# EasyEDA schematic Schematic.json
TITLE: HMI Board; REV: 0.2.0; Date: 2020-08-12; Sheet: 1/1; Drawn By: Nibha Akireddy; Company: Prakash Lab
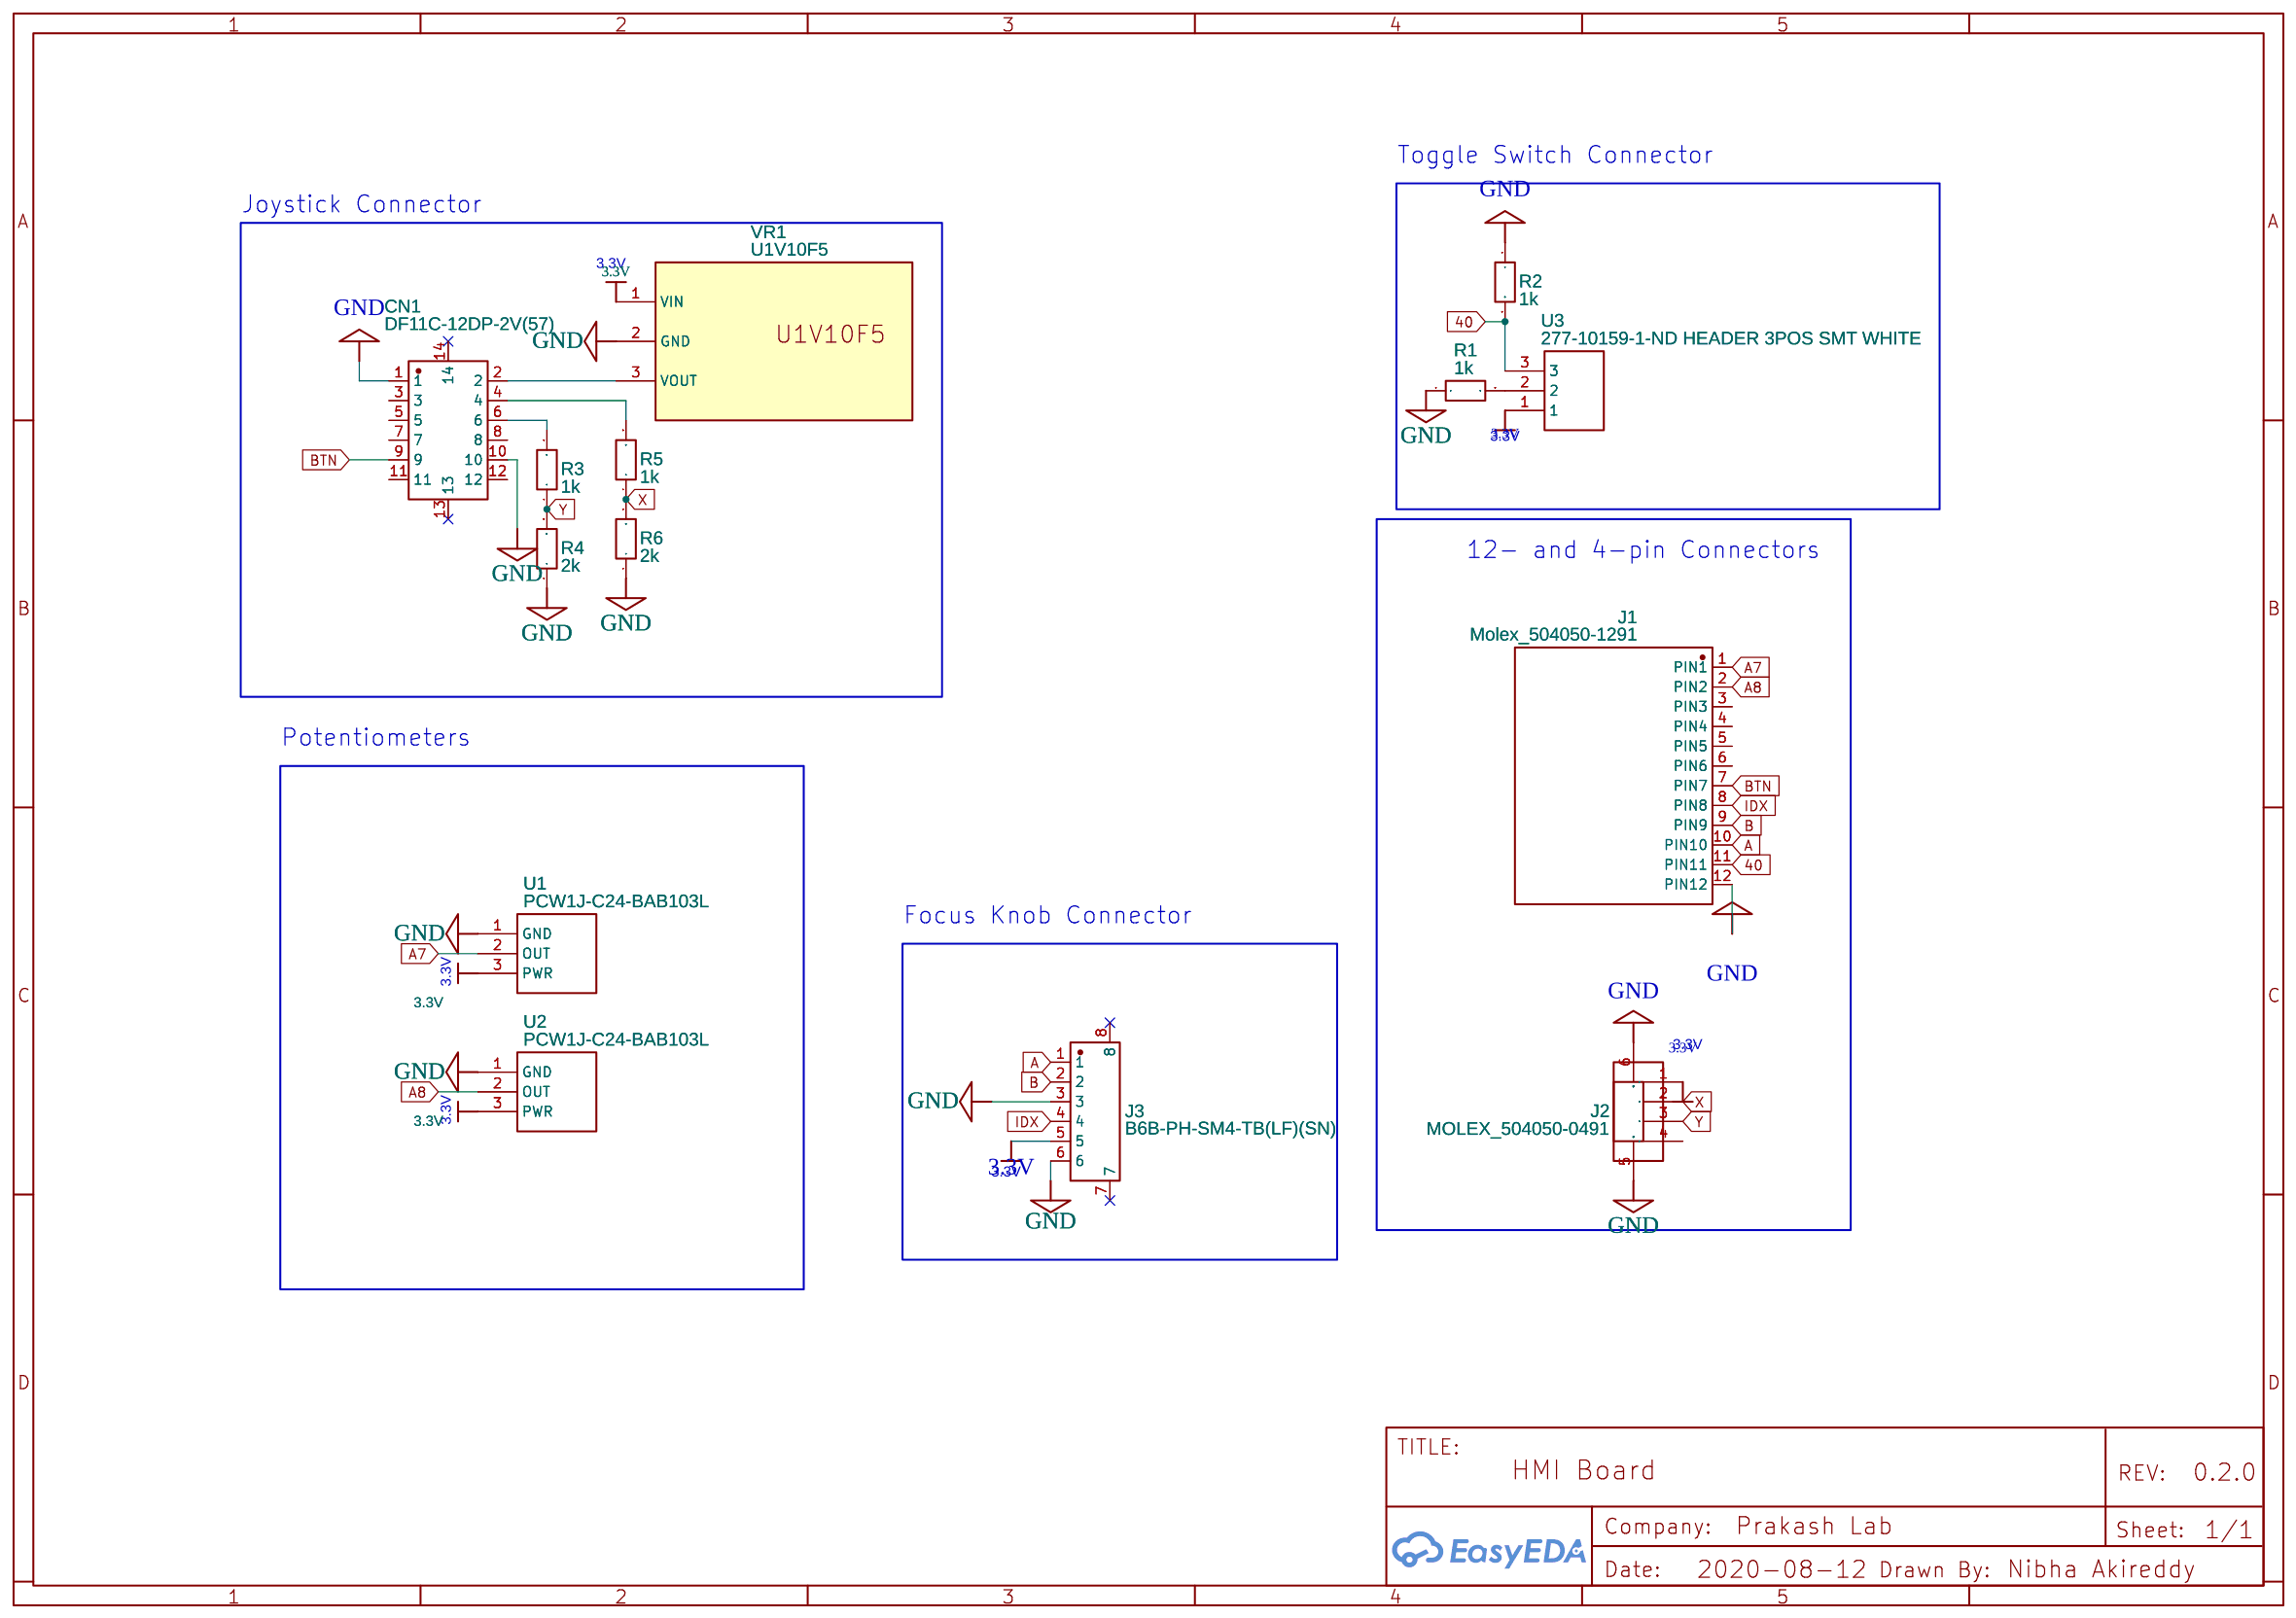
[diagram p0: schematic sheet]

## Parts
CN1  DF11C-12DP-2V(57)  [CONN-SMD_12P-P2.00_DF11C-12DP-2V(57)]
J1  Molex_504050-1291  [MOLEX_504050-1291]
J2  MOLEX_504050-0491  [MOLEX_504050-0491]
J3  B6B-PH-SM4-TB(LF)(SN)  [CONN-SMD_6P-P2.00_B6B-PH-SM4-TB(LF)(SN)]
R1  1k  [R0805]
R2  1k  [R0805]
R3  1k  [R0805]
R4  2k  [R0805]
R5  1k  [R0805]
R6  2k  [R0805]
U1  PCW1J-C24-BAB103L  [PCW1J-C24-BAB103L]
U2  PCW1J-C24-BAB103L  [PCW1J-C24-BAB103L]
U3  277-10159-1-ND HEADER 3POS SMT WHITE  [277-10159-1-ND HEADER 3POS SMT WHITE]
VR1  U1V10F5  [U1V10F5]

## Library data of the parts
CN1 = DF11C-12DP-2V(57): Supplier: LCSC; Supplier Part: C597834; Manufacturer: HRS(Hirose); Contributor: LCSC
J1 = Molex_504050-1291: Manufacturer Part: 504050-1291; Supplier: Digi-Key; Supplier Part: ‎WM16219CT-ND; Contributor: itai.strauss
J2 = MOLEX_504050-0491: Contributor: quentin.doret.ens2m; Manufacturer Part: 504050-0491; Supplier: RS-Online; Supplier Part: 789-8359; Manufacturer: MOLEX; link: https://www.molex.com/pdm_docs/sd/5040500491_sd.pdf
J3 = B6B-PH-SM4-TB(LF)(SN): Supplier: LCSC; Supplier Part: C471518; Manufacturer: JST Sales America; Contributor: LCSC
R1 = R_1206_EU: Contributor: LCEDA_Lib
R2-R6 = R_0201_EU: Contributor: LCEDA_Lib
U1 U2 = PCW1J-C24-BAB103L: Manufacturer: Bourns Inc.; Supplier: Digi-Key; Supplier Part: PCW1J-C24-BAB103L-ND; link: https://www.digikey.com/product-detail/en/bourns-inc/PCW1J-C24-BAB103L/PCW1J-C24-BAB103L-ND/3534177; Contributor: nibhaa
U3 = 277-10159-1-ND HEADER 3POS SMT WHITE: Manufacturer: Phoenix Contact; Manufacturer Part: 1778706; Supplier: Digi-Key; Supplier Part: 277-10159-1-ND; link: https://www.digikey.com/product-detail/en/phoenix-contact/1778706/277-10159-1-ND/5131541; Contributor: nibhaa
VR1 = U1V10F5: Contributor: winter2015; sourceId: YsmgyP7pj

## Nets
3.3V: J2.1 J3.5 U1.3(PWR) U2.3(PWR) U3.1 VR1.1(VIN)
GND: CN1.1 CN1.10 J1.12(PIN12) J2.5(MNT_1) J2.6(MNT_2) J3.3 J3.6 R1.1 R2.1 R4.1 R6.1 U1.1(GND) U2.1(GND) VR1.2(GND)
40: J1.11(PIN11) R2.2 U3.3
A: J1.10(PIN10) J3.1
A7: J1.1(PIN1) U1.2(OUT)
A8: J1.2(PIN2) U2.2(OUT)
B: J1.9(PIN9) J3.2
BTN: CN1.9 J1.7(PIN7)
IDX: J1.8(PIN8) J3.4
X: J2.2 R5.1 R6.2
Y: J2.3 R3.1 R4.2
Net-(CN1-2): CN1.2 VR1.3(VOUT)
Net-(CN1-4): CN1.4 R5.2
Net-(CN1-6): CN1.6 R3.2
Net-(R1-2): R1.2 U3.2

Not connected (* = marked no-connect by the designer): CN1 3 5 7 8 11 12 13* 14*; J1 3(PIN3) 4(PIN4) 5(PIN5) 6(PIN6); J2 4; J3 7* 8*

## Notes on the sheet
- Toggle Switch Connector
- Joystick Connector
- 3.3V
- 3.3V
- 12- and 4-pin Connectors
- Potentiometers
- Focus Knob Connector
- 3.3V
- 3.3V
- 3.3V
- 3.3V
